# EasyEDA Pro project ProPrj_smartmower_2025-07-31_08-52-16_2025-10-12.epro, schematic smartmower
Board Name: smartmower; Create Date: 2025-07-31; Page Name: Mother Board; Project Name: smartmower_2025-07-31_08-52-16; Schematic Name: smartmower; Update Date: 2025-10-06; Add into BOM: yes; Company: Your Company; Convert to PCB: yes; Date: 2025-07-09; Draw By: vito.ammirata; REV: 1.0; Sheet: 1/1; spicePre: .
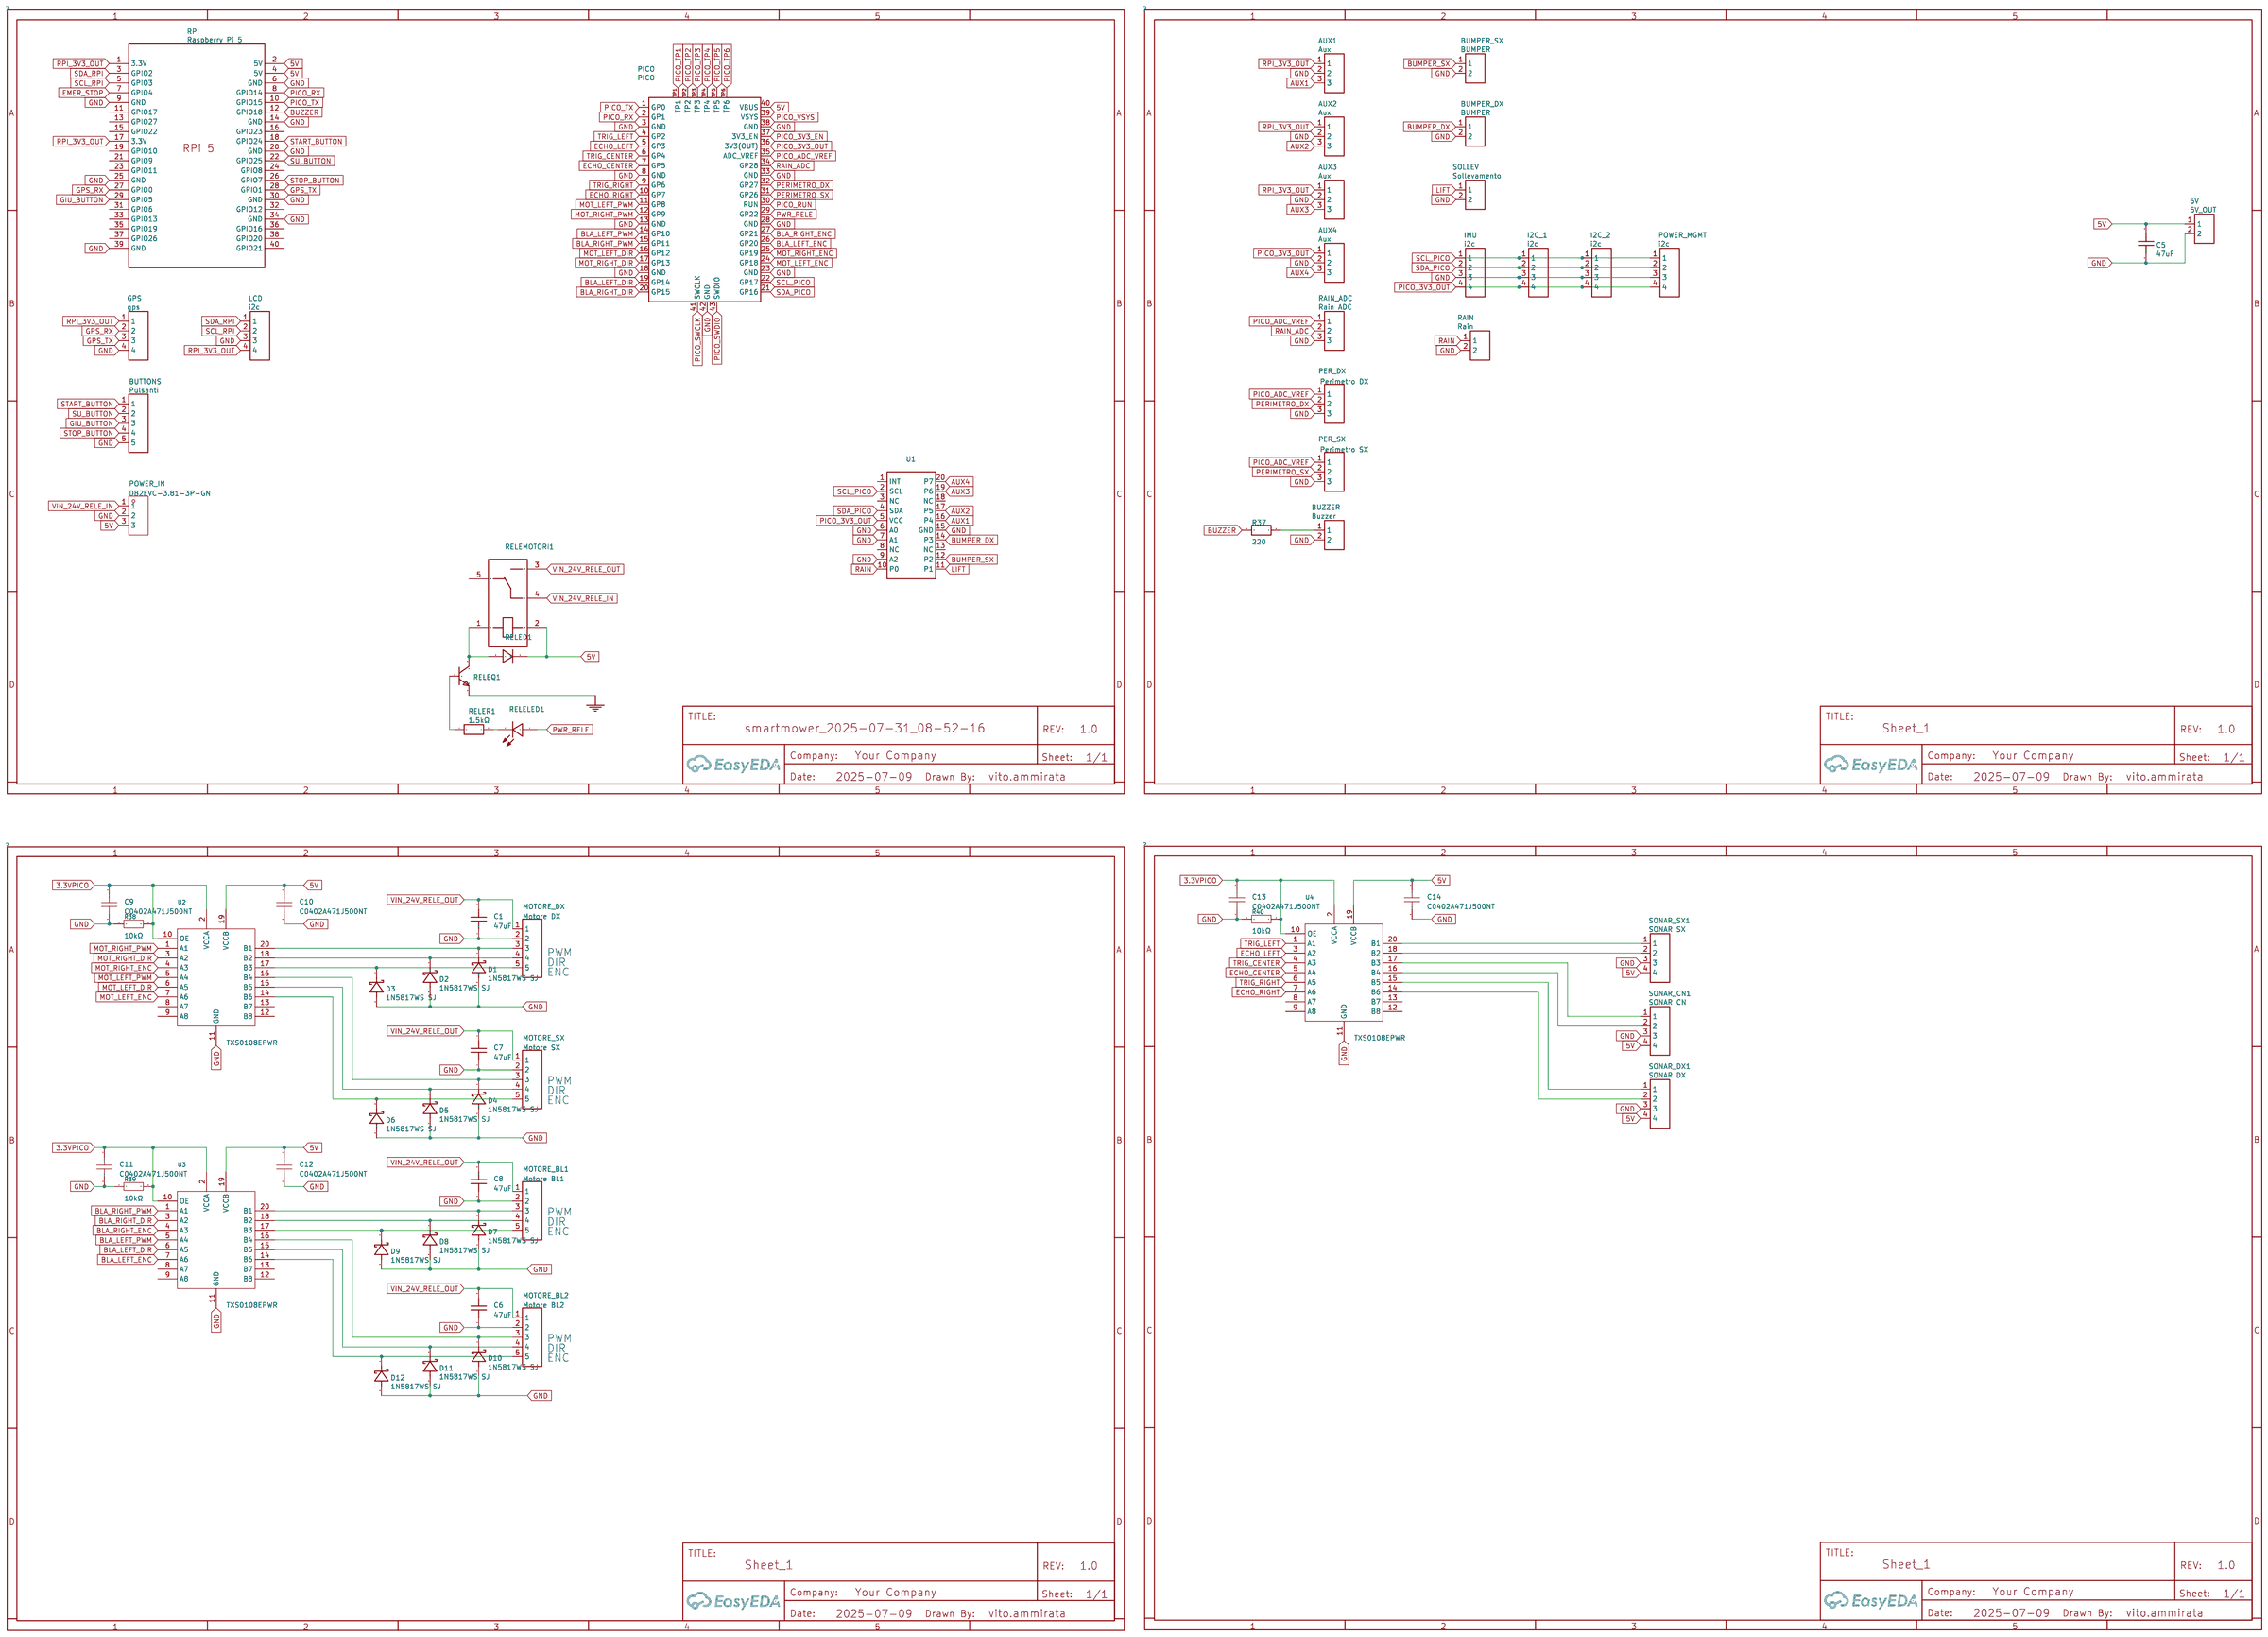
[diagram p1: schematic sheet]

## Parts
5V  5V_OUT  [CONN-TH_2P-P2.50_CNJM_CNJMA2501WV-2P]
AUX1  Aux  [CONN-TH_XH-3A]
AUX2  Aux  [CONN-TH_XH-3A]
AUX3  Aux  [CONN-TH_XH-3A]
AUX4  Aux  [CONN-TH_XH-3A]
BUMPER_DX  BUMPER  [CONN-TH_2P-P2.50_CNJM_CNJMA2501WV-2P]
BUMPER_SX  BUMPER  [CONN-TH_2P-P2.50_CNJM_CNJMA2501WV-2P]
BUTTONS  Pulsanti  [CONN-TH_5P-P2.50_CNJM_CNJMA2501WV-5P]
BUZZER  Buzzer  [CONN-TH_2P-P2.50_CNJM_CNJMA2501WV-2P]
C1  47uF  [CAP-SMD_BD6.3-L6.6-W6.6-LS7.2-FD]
C5  47uF  [CAP-SMD_BD6.3-L6.6-W6.6-LS7.2-FD]
C6  47uF  [CAP-SMD_BD6.3-L6.6-W6.6-LS7.2-FD]
C7  47uF  [CAP-SMD_BD6.3-L6.6-W6.6-LS7.2-FD]
C8  47uF  [CAP-SMD_BD6.3-L6.6-W6.6-LS7.2-FD]
C9  C0402A471J500NT  [C0402]
C10  C0402A471J500NT  [C0402]
C11  C0402A471J500NT  [C0402]
C12  C0402A471J500NT  [C0402]
C13  C0402A471J500NT  [C0402]
C14  C0402A471J500NT  [C0402]
D1  1N5817WS SJ  [SOD-323_L1.7-W1.3-LS2.6-RD-1]
D2  1N5817WS SJ  [SOD-323_L1.7-W1.3-LS2.6-RD-1]
D3  1N5817WS SJ  [SOD-323_L1.7-W1.3-LS2.6-RD-1]
D4  1N5817WS SJ  [SOD-323_L1.7-W1.3-LS2.6-RD-1]
D5  1N5817WS SJ  [SOD-323_L1.7-W1.3-LS2.6-RD-1]
D6  1N5817WS SJ  [SOD-323_L1.7-W1.3-LS2.6-RD-1]
D7  1N5817WS SJ  [SOD-323_L1.7-W1.3-LS2.6-RD-1]
D8  1N5817WS SJ  [SOD-323_L1.7-W1.3-LS2.6-RD-1]
D9  1N5817WS SJ  [SOD-323_L1.7-W1.3-LS2.6-RD-1]
D10  1N5817WS SJ  [SOD-323_L1.7-W1.3-LS2.6-RD-1]
D11  1N5817WS SJ  [SOD-323_L1.7-W1.3-LS2.6-RD-1]
D12  1N5817WS SJ  [SOD-323_L1.7-W1.3-LS2.6-RD-1]
GPS  gps  [CONN-TH_4P-P2.50-XH2.54-4P]
I2C_1  i2c  [CONN-TH_4P-P2.50-XH2.54-4P]
I2C_2  i2c  [CONN-TH_4P-P2.50-XH2.54-4P]
IMU  i2c  [CONN-TH_4P-P2.50-XH2.54-4P]
LCD  i2c  [CONN-TH_4P-P2.50-XH2.54-4P]
MOTORE_BL1  Motore BL1  [CONN-TH_5P-P2.50_CNJM_CNJMA2501WV-5P]
MOTORE_BL2  Motore BL2  [CONN-TH_5P-P2.50_CNJM_CNJMA2501WV-5P]
MOTORE_DX  Motore DX  [CONN-TH_5P-P2.50_CNJM_CNJMA2501WV-5P]
MOTORE_SX  Motore SX  [CONN-TH_5P-P2.50_CNJM_CNJMA2501WV-5P]
PER_DX  Perimetro DX  [CONN-TH_XH-3A]
PER_SX  Perimetro SX  [CONN-TH_XH-3A]
PICO  PICO  [COMM-SMD_L51.0-W21.0-P2.54_SC0916]
POWER_IN  DB2EVC-3.81-3P-GN  [CONN-TH_3P-P3.81_DB2EVC-3.81-3P]
POWER_MGMT  i2c  [CONN-TH_4P-P2.50-XH2.54-4P]
R37  220  [R0603]
R38  10kΩ  [R0402]
R39  10kΩ  [R0402]
R40  10kΩ  [R0402]
RAIN  Rain  [CONN-TH_2P-P2.50_CNJM_CNJMA2501WV-2P]
RAIN_ADC  Rain ADC  [CONN-TH_XH-3A]
RELED1  1N4007F  [SMAF_L3.5-W2.6-LS4.7-RD]
RELELED1  ERR  [LED0805-FD]
RELEMOTORI1  HRS3FNH-S-DC5V-A  [RELAY-TH_HRS3FNH-X-X-A]
RELEQ1  S8050_C2146  [SOT-23-3_L3.0-W1.7-P0.95-LS2.9-BR]
RELER1  1.5kΩ  [R1210]
RPI  Raspberry Pi 5  [HDR-20X2/2.54]
SOLLEV  Sollevamento  [CONN-TH_2P-P2.50_CNJM_CNJMA2501WV-2P]
SONAR_CN1  SONAR CN  [CONN-TH_4P-P2.50-XH2.54-4P]
SONAR_DX1  SONAR DX  [CONN-TH_4P-P2.50-XH2.54-4P]
SONAR_SX1  SONAR SX  [CONN-TH_4P-P2.50-XH2.54-4P]
U1  PCF8574PWR  [TSSOP-20_L6.5-W4.4-P0.65-LS6.4-BL]
U2  TXS0108EPWR  [TSSOP-20_L6.5-W4.4-P0.65-LS6.4-BL]
U3  TXS0108EPWR  [TSSOP-20_L6.5-W4.4-P0.65-LS6.4-BL]
U4  TXS0108EPWR  [TSSOP-20_L6.5-W4.4-P0.65-LS6.4-BL]

## Library data of the parts
5V = 5V_OUT: Supplier: LCSC; Supplier Part: C5151115; Manufacturer: CNJM(九木精密); Manufacturer Part: CNJMA2501WV-2P; Contributor: lcsc; spicePre: C; spiceSymbolName: CNJMA2501WV-2P
AUX1-AUX4 PER_DX PER_SX RAIN_ADC = Rain: Supplier: LCSC; Supplier Part: C2885641; Manufacturer: null; Manufacturer Part: XHB-3A; JLCPCB Part Class: Extended Part; Contributor: LCSC; spicePre: U; spiceSymbolName: XHB-3A_C2885641
BUMPER_DX BUMPER_SX = BUMPER: Supplier: LCSC; Supplier Part: C5151115; Manufacturer: CNJM(九木精密); Manufacturer Part: CNJMA2501WV-2P; Contributor: lcsc; spicePre: C; spiceSymbolName: CNJMA2501WV-2P
BUTTONS = Pulsanti: Supplier: LCSC; Supplier Part: C48579976; Manufacturer: CJT(长江连接器); Manufacturer Part: A2501WV-5P; Contributor: lcsc; spicePre: C; spiceSymbolName: A2501WV-5P_C48579976
BUZZER = Buzzer: Supplier: LCSC; Supplier Part: C5151115; Manufacturer: CNJM(九木精密); Manufacturer Part: CNJMA2501WV-2P; Contributor: lcsc; spicePre: C; spiceSymbolName: CNJMA2501WV-2P
C1 C5-C8 = RVT47UF35V67RV0039: Capacitance:47uF Tolerance:±20% Tolerance:±20% Voltage Rating:35V Ripple Current:16.4mA@120Hz Equivalent Series Resistance(ESR):- Diameter:6.3mm Height - Seated (Max):5.4mm Lifetime:2000hrs@105℃ Operating Temperature:-55℃~+105℃ Operating Temperature:-55℃~; LCSC Part Name: 47uF ±20% 35V; Supplier Part: C2836440; Manufacturer: KNSCHA(科尼盛); Supplier Footprint: SMD,D6.3xL5.4mm; JLCPCB Part Class: Extended Part; Datasheet: https://atta.szlcsc.com/upload/public/pdf/source/20210528/C2836440_FB61BB3A7A46B9CC2A608A35871DBF0C.pdf; Supplier: LCSC; Tolerance: ±20%; Voltage Rating: 35V; Ripple Current: 16.4mA@120Hz; Diameter: 6.3mm; Height - Seated (Max): 5.4mm; Lifetime: 2000hrs@105℃; Operating Temperature: -55℃~+105℃
C9-C14 = C0402A471J500NT: Supplier Part: C17702725; Manufacturer: TORCH(火炬); Supplier Footprint: 0402; JLCPCB Part Class: Extended Part; Datasheet: https://atta.szlcsc.com/upload/public/pdf/source/20230927/0E50D64F4D2F311F509CBC9B8B2C0B7B.pdf; Supplier: LCSC
D1-D12 = 1N5817WS SJ: Supplier: LCSC; Supplier Part: C2828424; Manufacturer: CBI(创基); Manufacturer Part: 1N5817WS; JLCPCB Part Class: Extended Part; Contributor: lcsc; spicePre: D
GPS I2C_1 I2C_2 IMU LCD POWER_MGMT = i2c: Supplier: LCSC; Supplier Part: C5151117; Manufacturer: CNJM(九木精密); Manufacturer Part: CNJMA2501WV-4P; JLCPCB Part Class: Extended Part; Contributor: lcsc; spicePre: U; spiceSymbolName: CNJMA2501WV-4P
MOTORE_BL1 MOTORE_BL2 = Motore BL2: Supplier: LCSC; Supplier Part: C48579976; Manufacturer: CJT(长江连接器); Manufacturer Part: A2501WV-5P; Contributor: lcsc; spicePre: C; spiceSymbolName: A2501WV-5P_C48579976
MOTORE_DX = Motore DX: Supplier: LCSC; Supplier Part: C48579976; Manufacturer: CJT(长江连接器); Manufacturer Part: A2501WV-5P; Contributor: lcsc; spicePre: C; spiceSymbolName: A2501WV-5P_C48579976
MOTORE_SX = Motore SX: Supplier: LCSC; Supplier Part: C48579976; Manufacturer: CJT(长江连接器); Manufacturer Part: A2501WV-5P; Contributor: lcsc; spicePre: C; spiceSymbolName: A2501WV-5P_C48579976
PICO = PICO: Supplier: LCSC; Supplier Part: C7203002; Manufacturer: Raspberry Pi(树莓派); JLCPCB Part Class: Extended Part; Contributor: lcsc; spicePre: U
POWER_IN = DB2EVC-3.81-3P-GN: Connector Type:Board Side/Socket - Closed Number of Positions or Pins:1x3P Pitch:3.81mm Color:Green Mounting Type:Straight Pin Number of Pins:3P Number of Rows:1 Number of PINs Per Row:3 Current Rating:10A Voltage Rating (Max):250V Operating Temperature:-; LCSC Part Name: 3.81mm 1x3P 排数:1 每排P数:3; Supplier Part: C395692; Manufacturer: DORABO(地博电气); Supplier Footprint: 插件,P=3.81mm; JLCPCB Part Class: Extended Part; Datasheet: https://atta.szlcsc.com/upload/public/pdf/source/20230106/E295F87ABDAA44E449E4D4A582259339.pdf; Supplier: LCSC; Connector Type: Board Side/Socket - Closed; Number of Positions or Pins: 1x3P; Pitch: 3.81mm; Color: Green; Mounting Type: Straight Pin; Number of Pins: 3P; Number of Rows: 1; Number of PINs Per Row: 3; Current Rating: 10A; Voltage Rating (Max): 250V; Operating Temperature: -40℃~+105℃
R37 = 4.7k: nameAlias: Value(Ω); Contributor: LCEDA_Lib; spicePre: R; spiceSymbolName: R_0603_EU
R38-R40 = RC0402JR-0710KL: Type:Thick Film Resistors Resistance:10kΩ Tolerance:±5% Tolerance:±5% Power(Watts):62.5mW Voltage-Supply(Max):50V Temperature Coefficient:±100ppm/℃ Temperature Coefficient:±100ppm/℃ Operating Temperature:-55℃~+155℃ Operating Temperature:-55℃~+155℃; LCSC Part Name: 厚膜电阻 10kΩ ±5% 62.5mW; Supplier Part: C60489; Manufacturer: YAGEO(国巨); Supplier Footprint: 0402; JLCPCB Part Class: Extended Part; Datasheet: https://atta.szlcsc.com/upload/public/pdf/source/20170428/1493376821999.pdf; Supplier: LCSC; Type: Thick Film Resistors; Tolerance: ±5%; Power(Watts): 62.5mW; Voltage-Supply(Max): 50V; Temperature Coefficient: ±100ppm/℃; Operating Temperature: -55℃~+155℃
RAIN SOLLEV = Sollevamento: Supplier: LCSC; Supplier Part: C5151115; Manufacturer: CNJM(九木精密); Manufacturer Part: CNJMA2501WV-2P; Contributor: lcsc; spicePre: C; spiceSymbolName: CNJMA2501WV-2P
RELED1 = 1N4007F: Supplier: LCSC; Manufacturer: SK; Supplier Part: C110856; JLCPCB Part Class: Extend; LCSC Assembly: Yes; spicePre: D
RELELED1 = ERR: Supplier: LCSC; Manufacturer: NATIONSTAR; Manufacturer Part: FHRK-620D; image: //image.lceda.cn/szlcsc/C84256.jpg; Supplier Part: C84256; JLCPCB Part Class: Basic; LCSC Assembly: Yes; spicePre: L; spiceSymbolName: FC-2012HRK-620D
RELEMOTORI1 = HRS3FNH-S-DC5V-A: Coil Voltage:5V Contact Form:1 Form A: 1A (SPST-NO) Number of Pins:4 Contact Rating:10A Switching Voltage(Max):30V@DC；277V@AC Coil Rated Power:200mW Contact Material:- Switching Current(Max):10A Coil Type:- Coil Resistance:- Contact Resistance:100mΩ Opera; LCSC Part Name: 超小型功率继电器; Supplier Part: C124241; Manufacturer: HKE(汇港); Supplier Footprint: 插件,10.2x18.2mm; JLCPCB Part Class: Extended Part; Datasheet: https://atta.szlcsc.com/upload/public/pdf/source/20170818/C124241_1503051174636895160.pdf; Supplier: LCSC; Coil Voltage: 5V; Contact Form: 1 Form A: 1A (SPST-NO); Number of Pins: 4; Contact Rating: 10A; Switching Voltage(Max): 30V@DC；277V@AC; Coil Rated Power: 200mW; Switching Current(Max): 10A; Contact Resistance: 100mΩ; Operate Time: 10ms; Release Time: 5ms; Operating Temperature: -40℃~+85℃
RELEQ1 = S8050_C2146: Supplier: LCSC; Manufacturer: CJ; Manufacturer Part: S8050; image: //image.lceda.cn/szlcsc/C2146.jpg; Supplier Part: C2146; JLCPCB Part Class: Basic; LCSC Assembly: Yes; spicePre: Q
RELER1 = FRC1210J152TS: Type:Thick Film Resistors Resistance:1.5kΩ Tolerance:±5% Tolerance:±5% Power(Watts): Overload Voltage (Max): Temperature Coefficient:±100ppm/℃ Temperature Coefficient:±100ppm/℃; LCSC Part Name: 厚膜电阻 1.5kΩ ±5% 500mW; Supplier Part: C3000602; Manufacturer: FOJAN(富捷); Supplier Footprint: 1210; JLCPCB Part Class: Extended Part; Datasheet: https://atta.szlcsc.com/upload/public/pdf/source/20240815/E4F1531D1C60085E6B84901F2C57F42A.pdf; Supplier: LCSC; Type: Thick Film Resistors; Tolerance: ±5%; Temperature Coefficient: ±100ppm/℃
RPI = Raspberry Pi 5: Manufacturer: Raspberry Pi 5 4GB; Contributor: lav4; spicePre: R
SONAR_CN1 = SONAR CN: Supplier: LCSC; Supplier Part: C5151117; Manufacturer: CNJM(九木精密); Manufacturer Part: CNJMA2501WV-4P; JLCPCB Part Class: Extended Part; Contributor: lcsc; spicePre: U; spiceSymbolName: CNJMA2501WV-4P
SONAR_DX1 = SONAR DX: Supplier: LCSC; Supplier Part: C5151117; Manufacturer: CNJM(九木精密); Manufacturer Part: CNJMA2501WV-4P; JLCPCB Part Class: Extended Part; Contributor: lcsc; spicePre: U; spiceSymbolName: CNJMA2501WV-4P
SONAR_SX1 = SONAR SX: Supplier: LCSC; Supplier Part: C5151117; Manufacturer: CNJM(九木精密); Manufacturer Part: CNJMA2501WV-4P; JLCPCB Part Class: Extended Part; Contributor: lcsc; spicePre: U; spiceSymbolName: CNJMA2501WV-4P
U1 = PCF8574PWR: Interface:I2C Interrupt Output:Interrupt Output Output Type:- Voltage - Supply:2.5V~6V Voltage - Supply:2.5V~6V Current - Output Low(IOL):- Current - Output High(IOH):- Clock Frequency:100kHz Operating Temperature:-40℃~+85℃ Operating Temperature:-40℃~+85℃; Supplier Part: C882809; Manufacturer: TI(德州仪器); Supplier Footprint: TSSOP-20; JLCPCB Part Class: Extended Part; Datasheet: https://www.ti.com/cn/lit/gpn/pcf8574; Supplier: LCSC; Interface: I2C; Interrupt Output: Interrupt Output; Voltage - Supply: 2.5V~6V; Clock Frequency: 100kHz; Operating Temperature: -40℃~+85℃
U2-U4 = TXS0108EPWR: Channel Type:Bidirectional Input Signal:- Output Signal:- Data Rate:60Mbps Voltage - Supply(VCCA):1.4V~3.6V Voltage - Supply(VCCA):1.4V~3.6V Voltage - Supply(VCCB):1.65V~5.5V Voltage - Supply(VCCB):1.65V~5.5V Number of Circuits:1 Number of Circuits:8 Outp; LCSC Part Name: 60Mbps 8位双向电平转换器; Supplier Part: C17206; Manufacturer: TI(德州仪器); Supplier Footprint: TSSOP-20; JLCPCB Part Class: Extended Part; Datasheet: http://www.ti.com/cn/lit/gpn/txs0108e; Supplier: LCSC; Channel Type: Bidirectional; Data Rate: 60Mbps; Voltage - Supply(VCCA): 1.4V~3.6V; Voltage - Supply(VCCB): 1.65V~5.5V; Number of Circuits: 8; Output Type: Open Drain；Push-pull; Operating Temperature: -40℃~+85℃; Features: Automatic Direction Detection

## Nets
3.3VPICO: C9.1 C11.1 C13.1 R38.2 R39.2 R40.2 U2.2(VCCA) U2.10(OE) U3.2(VCCA) U3.10(OE) U4.2(VCCA) U4.10(OE)
5V: 5V.1 C5.2 C10.1 C12.1 C14.1 PICO.40(VBUS) POWER_IN.3 RELED1.1(C) RELEMOTORI1.2 RPI.2(5V) RPI.4(5V) SONAR_CN1.4 SONAR_DX1.4 SONAR_SX1.4 U2.19(VCCB) U3.19(VCCB) U4.19(VCCB)
GND: 5V.2 AUX1.2 AUX2.2 AUX3.2 AUX4.2 BUMPER_DX.2 BUMPER_SX.2 BUTTONS.5 BUZZER.2 C1.1 C5.1 C6.1 C7.1 C8.1 C9.2 C10.2 C11.2 C12.2 C13.2 C14.2 D1.2(A) D2.2(A) D3.2(A) D4.2(A) D5.2(A) D6.2(A) D7.2(A) D8.2(A) D9.2(A) D10.2(A) D11.2(A) D12.2(A) GPS.4 I2C_1.3 I2C_2.3 IMU.3 LCD.3 MOTORE_BL1.2 MOTORE_BL2.2 MOTORE_DX.2 MOTORE_SX.2 PER_DX.3 PER_SX.3 PICO.3(GND) PICO.8(GND) PICO.13(GND) PICO.18(GND) PICO.23(GND) PICO.28(GND) PICO.33(GND) PICO.38(GND) PICO.42(GND) POWER_IN.2 POWER_MGMT.3 R38.1 R39.1 R40.1 RAIN.2 RAIN_ADC.3 RELEQ1.2(E) RPI.6(GND) RPI.9(GND) RPI.14(GND) RPI.20(GND) RPI.25(GND) RPI.30(GND) RPI.34(GND) RPI.39(GND) SOLLEV.2 SONAR_CN1.3 SONAR_DX1.3 SONAR_SX1.3 U1.6(A0) U1.7(A1) U1.9(A2) U1.15(GND) U2.11(GND) U3.11(GND) U4.11(GND)
VIN_24V_RELE_IN: POWER_IN.1 RELEMOTORI1.4
VIN_24V_RELE_OUT: C1.2 C6.2 C7.2 C8.2 MOTORE_BL1.1 MOTORE_BL2.1 MOTORE_DX.1 MOTORE_SX.1 RELEMOTORI1.3
AUX1: AUX1.3 U1.16(P4)
AUX2: AUX2.3 U1.17(P5)
AUX3: AUX3.3 U1.19(P6)
AUX4: AUX4.3 U1.20(P7)
BLA_LEFT_DIR: PICO.19(GP14) U3.6(A5)
BLA_LEFT_ENC: PICO.26(GP20) U3.7(A6)
BLA_LEFT_PWM: PICO.14(GP10) U3.5(A4)
BLA_RIGHT_DIR: PICO.20(GP15) U3.3(A2)
BLA_RIGHT_ENC: PICO.27(GP21) U3.4(A3)
BLA_RIGHT_PWM: PICO.15(GP11) U3.1(A1)
BUMPER_DX: BUMPER_DX.1 U1.14(P3)
BUMPER_SX: BUMPER_SX.1 U1.12(P2)
BUZZER: R37.1 RPI.12(GPIO18)
ECHO_CENTER: PICO.7(GP5) U4.5(A4)
ECHO_LEFT: PICO.5(GP3) U4.3(A2)
ECHO_RIGHT: PICO.10(GP7) U4.7(A6)
EMER_STOP: RPI.7(GPIO4)
GIU_BUTTON: BUTTONS.3 RPI.29(GPIO5)
GPS_RX: GPS.2 RPI.27(GPIO0)
GPS_TX: GPS.3 RPI.28(GPIO1)
LIFT: SOLLEV.1 U1.11(P1)
MOT_LEFT_DIR: PICO.16(GP12) U2.6(A5)
MOT_LEFT_ENC: PICO.24(GP18) U2.7(A6)
MOT_LEFT_PWM: PICO.11(GP8) U2.5(A4)
MOT_RIGHT_DIR: PICO.17(GP13) U2.3(A2)
MOT_RIGHT_ENC: PICO.25(GP19) U2.4(A3)
MOT_RIGHT_PWM: PICO.12(GP9) U2.1(A1)
PERIMETRO_DX: PER_DX.2 PICO.32(GP27)
PERIMETRO_SX: PER_SX.2 PICO.31(GP26)
PICO_3V3_EN: PICO.37(3V3_EN)
PICO_3V3_OUT: AUX4.1 I2C_1.4 I2C_2.4 IMU.4 PICO.36(3V3(OUT)) POWER_MGMT.4 U1.5(VCC)
PICO_ADC_VREF: PER_DX.1 PER_SX.1 PICO.35(ADC_VREF) RAIN_ADC.1
PICO_RUN: PICO.30(RUN)
PICO_RX: PICO.2(GP1) RPI.8(GPIO14)
PICO_SWCLK: PICO.41(SWCLK)
PICO_SWDIO: PICO.43(SWDIO)
PICO_TP1: PICO.TP1
PICO_TP2: PICO.TP2
PICO_TP3: PICO.TP3
PICO_TP4: PICO.TP4
PICO_TP5: PICO.TP5
PICO_TP6: PICO.TP6
PICO_TX: PICO.1(GP0) RPI.10(GPIO15)
PICO_VSYS: PICO.39(VSYS)
PWR_RELE: PICO.29(GP22) RELELED1.1(A)
RAIN: RAIN.1 U1.10(P0)
RAIN_ADC: PICO.34(GP28) RAIN_ADC.2
RPI_3V3_OUT: AUX1.1 AUX2.1 AUX3.1 GPS.1 LCD.4 RPI.1(3.3V) RPI.17(3.3V)
SCL_PICO: I2C_1.1 I2C_2.1 IMU.1 PICO.22(GP17) POWER_MGMT.1 U1.2(SCL)
SCL_RPI: LCD.2 RPI.5(GPIO3)
SDA_PICO: I2C_1.2 I2C_2.2 IMU.2 PICO.21(GP16) POWER_MGMT.2 U1.4(SDA)
SDA_RPI: LCD.1 RPI.3(GPIO2)
START_BUTTON: BUTTONS.1 RPI.18(GPIO24)
STOP_BUTTON: BUTTONS.4 RPI.26(GPIO7)
SU_BUTTON: BUTTONS.2 RPI.22(GPIO25)
TRIG_CENTER: PICO.6(GP4) U4.4(A3)
TRIG_LEFT: PICO.4(GP2) U4.1(A1)
TRIG_RIGHT: PICO.9(GP6) U4.6(A5)
$1N29: RELELED1.2(K) RELER1.2
$1N30: RELEQ1.1(B) RELER1.1
$1N33: RELED1.2(A) RELEMOTORI1.1 RELEQ1.3(C)
$1N51: SONAR_SX1.1 U4.20(B1)
$1N53: SONAR_SX1.2 U4.18(B2)
$1N27511: BUZZER.1 R37.2
$1N32829: D1.1(K) MOTORE_DX.3 U2.20(B1)
$1N32835: D2.1(K) MOTORE_DX.4 U2.18(B2)
$1N32841: D3.1(K) MOTORE_DX.5 U2.17(B3)
$1N33200: D6.1(K) MOTORE_SX.5 U2.14(B6)
$1N33206: D5.1(K) MOTORE_SX.4 U2.15(B5)
$1N33216: D4.1(K) MOTORE_SX.3 U2.16(B4)
$1N34380: D7.1(K) MOTORE_BL1.3 U3.20(B1)
$1N34384: D8.1(K) MOTORE_BL1.4 U3.18(B2)
$1N34389: D9.1(K) MOTORE_BL1.5 U3.17(B3)
$1N34420: D10.1(K) MOTORE_BL2.3 U3.16(B4)
$1N34426: D11.1(K) MOTORE_BL2.4 U3.15(B5)
$1N34436: D12.1(K) MOTORE_BL2.5 U3.14(B6)
$1N34966: SONAR_CN1.1 U4.17(B3)
$1N34975: SONAR_CN1.2 U4.16(B4)
$1N34985: SONAR_DX1.1 U4.15(B5)
$1N34995: SONAR_DX1.2 U4.14(B6)

Not connected (* = marked no-connect by the designer): RELEMOTORI1 5; RPI 11(GPIO17) 13(GPIO27) 15(GPIO22) 16(GPIO23) 19(GPIO10) 21(GPIO9) 23(GPIO11) 24(GPIO8) 31(GPIO6) 32(GPIO12) 33(GPIO13) 35(GPIO19) 36(GPIO16) 37(GPIO26) 38(GPIO20) 40(GPIO21); U1 1(INT) 3(NC) 8(NC) 13(NC) 18(NC); U2 8(A7) 9(A8) 12(B8) 13(B7); U3 8(A7) 9(A8) 12(B8) 13(B7); U4 8(A7) 9(A8) 12(B8) 13(B7)

## Notes on the sheet
- DIR
- PWM
- ENC
- PWM
- DIR
- ENC
- PWM
- DIR
- ENC
- PWM
- DIR
- ENC
